# Altium schematic sheet 8_电子天平_温度检测.SchDoc: 电子天平_温度检测
size A4; Date: 2020/01/07; ApprovedBy: Riggin; CheckedBy: Riggin; Author: Riggin; DrawnBy: Riggin; Engineer: Riggin; DocumentNumber: 1; Revision: V1.0; SheetNumber: 1; SheetTotal: 8; Time: 14:09:34; ProjectName: 电子天平
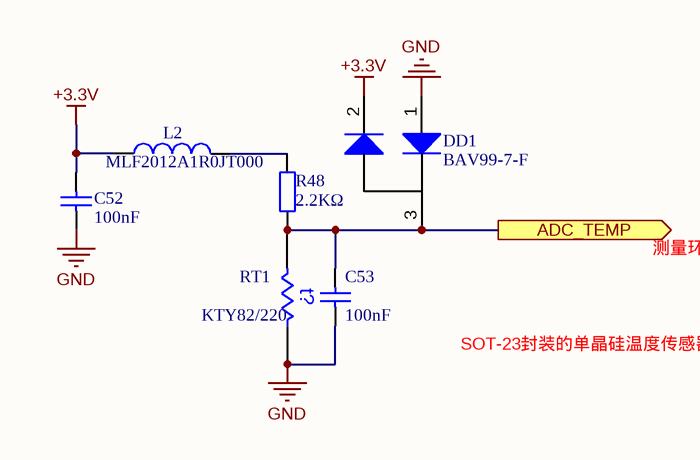
[diagram p0: 8_电子天平_温度检测.SchDoc]

## Parts
C52  100nF  [LC-0805_C]
C53  100nF  [LC-0805_C]
DD1  BAV99-7-F  [LC-SOT-23(SOT-23-3)]
L2  MLF2012A1R0JT000  [LC-0805_L]
R48  2.2KΩ  [LC-0805_R]
RT1  KTY82/220  [LC-SOT-23(SOT-23-3)]

## Ports
ADC_TEMP (out)

## Nets
+3.3V: C52.2 DD1.2(A) L2.2
GND: C52.1 C53.1 DD1.1(A) RT1.1
ADC_TEMP: C53.2 DD1.3(K) R48.1 RT1.2 ; port ADC_TEMP
NetL2_1: L2.1 R48.2

## Notes on the sheet
- 测量环境温度。
- (near RT1) SOT-23封装的单晶硅温度传感器（正温度系数）
- Title
- Company:
- Address:
- 广东省广州市
- DZT Studio
- Size:
- Date:
- Drawn By:
- A4
- Riggin
- Time:
- Revision:
- Approved By:
- Sheet
- of
- Email:
- RigginLi@icloud.com
- Project:
- (in symbol Res Thermal) t?

## Library data of the parts
C52 C53 = Cap: MLCC; Value: 100pF; Published: 8-Jun-2000; LatestRevisionDate: 17-Jul-2002; LatestRevisionNote: Re-released for DXP Platform.; PackageReference: RAD-0.3; Publisher: Altium Limited; PackageDescription: Radial Cap, Thru-Hole; 2 Leads; 0.3 in Pin Spacing
DD1 = SOT-23 BAV99 A7W: 开关二极管; ComponentLink1Description: 供应商链接; ComponentLink1URL: http://www.szlcsc.com/product/details_2877.html; Package: SOT-23; Supplier: LC; SuppliersPartNumber: C2500
L2 = Inductor: 贴片电感; Code_IEC: 1005; Value: 10mH; Published: 8-Jun-2000; LatestRevisionDate: 29-May-2009; LatestRevisionNote: IPC-7351 Footprint Added.; PackageReference: 0402-A; Publisher: Altium Limited; PackageDescription: Chip Inductor; Code_JEITA: 0402
R48 = 0805 470KΩ (4703) 1%: 贴片电阻; ComponentLink1Description: 供应商链接; ComponentLink1URL: http://www.szlcsc.com/product/details_18397.html; Package: 0805; Supplier: LC; SuppliersPartNumber: C17709
RT1 = Res Thermal: Thermistor; Published: 24-Mar-1999; LatestRevisionDate: 29-May-2009; LatestRevisionNote: IPC-7351 Footprint Added.; PackageVersion: Mar-2003; PackageReference: 6-0805; Publisher: Altium Limited; PackageDescription: Chip Resistor 0805 Case Size; Code_IPC: RESC2012